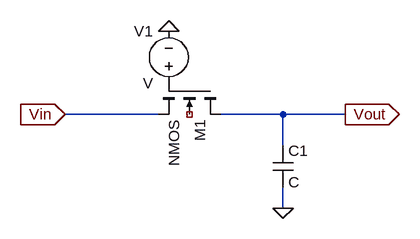
[diagram p0: schematic HW 7 #1 - Overall.asc]
HW 7 #1 - Overall.asc, the LTspice schematic file:
Version 4
SHEET 1 880 680
WIRE 112 144 -32 144
WIRE 304 144 208 144
WIRE 400 144 304 144
WIRE 304 192 304 144
WIRE 304 288 304 256
FLAG -32 144 Vin
IOPIN -32 144 In
FLAG 400 144 Vout
IOPIN 400 144 Out
FLAG 304 288 0
FLAG 128 16 0
SYMBOL nmos4 208 96 R90
SYMATTR InstName M1
SYMBOL cap 288 192 R0
SYMATTR InstName C1
SYMBOL voltage 128 112 R180
WINDOW 0 24 96 Left 2
WINDOW 3 24 16 Left 2
SYMATTR InstName V1

The netlist it stands for:
* HW 7 #1 - Overall.asc
M1 Vout P001 Vin NC_01 NMOS
C1 Vout 0 C
V1 P001 0 V
.model NMOS NMOS
.model PMOS PMOS
.lib standard.mos
.backanno
.end